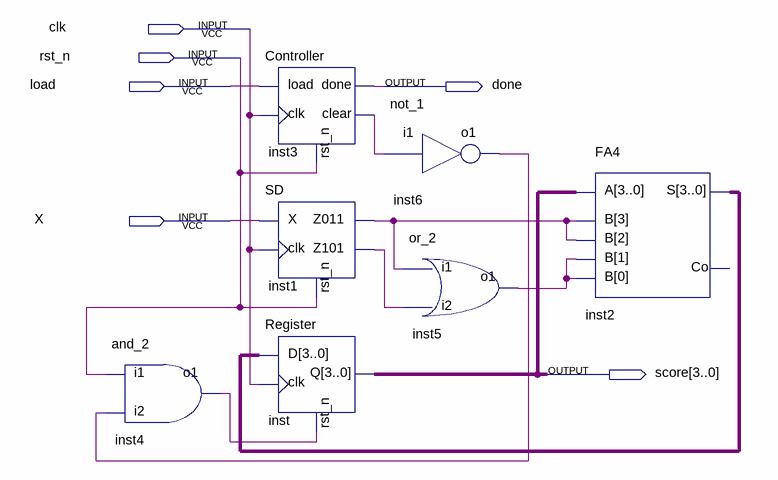
[diagram p0: schematic sheet]
// Quartus schematic WSC.bdf as structural Verilog: 7 symbols, 6 pins
module WSC (
  input  clk,
  input  rst_n,
  input  load,
  input  X,
  output done,
  output [3:0] score
);

  wire inst1_z011, inst1_z101, inst3_clear, inst4_o1, inst5_o1, inst6_o1;
  wire [3:0] inst2_s;

  and_2 inst4 (.i1(rst_n), .i2(inst6_o1), .o1(inst4_o1));
  Controller inst3 (.rst_n(rst_n), .clk(clk), .load(load), .done(done), .clear(inst3_clear));
  SD inst1 (.X(X), .rst_n(rst_n), .clk(clk), .Z011(inst1_z011), .Z101(inst1_z101));
  Register inst (.D(inst2_s), .clk(clk), .rst_n(inst4_o1), .Q(score));
  not_1 inst6 (.i1(inst3_clear), .o1(inst6_o1));
  or_2 inst5 (.i1(inst1_z011), .i2(inst1_z101), .o1(inst5_o1));
  FA4 inst2 (.A(score), .B({{2{inst1_z011}}, {2{inst5_o1}}}), .S(inst2_s));  // open: Co
endmodule
